# Altium schematic sheet Programming Interface and Power.SchDoc
size A
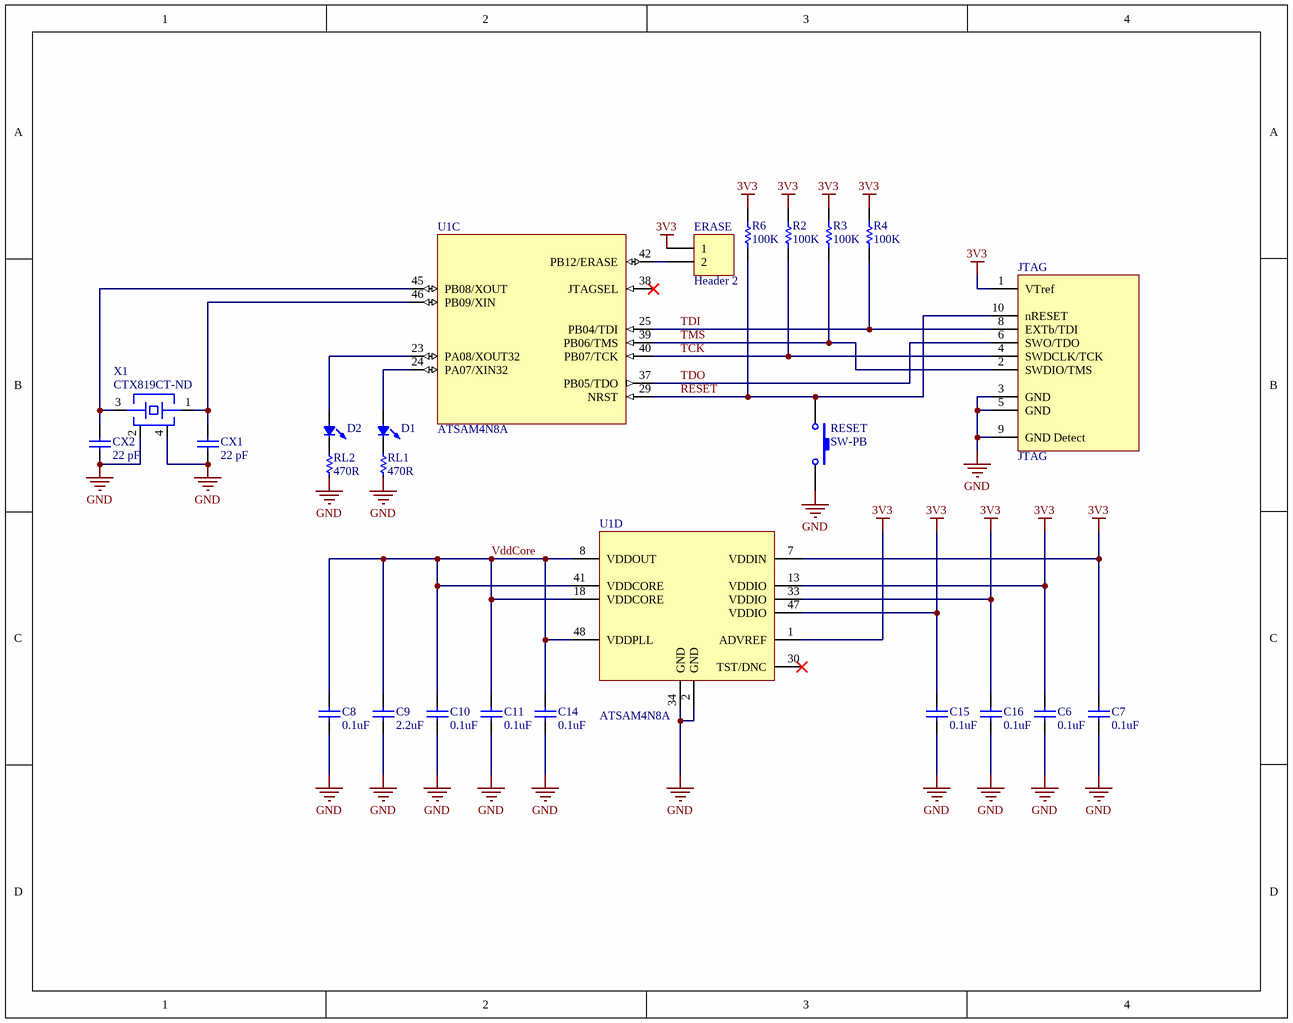
[diagram p0: Programming Interface and Power.SchDoc]

## Parts
C6  value 0.1uF  [0603C]  (hidden comment: Cap Semi)
C7  value 0.1uF  [0603C]  (hidden comment: Cap Semi)
C8  value 0.1uF  [0603C]  (hidden comment: Cap Semi)
C9  value 2.2uF  [1206C]  (hidden comment: Cap Semi)
C10  value 0.1uF  [0603C]  (hidden comment: Cap Semi)
C11  value 0.1uF  [0603C]  (hidden comment: Cap Semi)
C14  value 0.1uF  [0603C]  (hidden comment: Cap Semi)
C15  value 0.1uF  [0603C]  (hidden comment: Cap Semi)
C16  value 0.1uF  [0603C]  (hidden comment: Cap Semi)
CX1  value 22 pF  [0603C]  (hidden comment: Cap Semi)
CX2  value 22 pF  [0603C]  (hidden comment: Cap Semi)
D1  LED0  [0603 SMT LED]  (value not drawn)
D2  LED0  [0603 SMT LED]  (value not drawn)
ERASE  Header 2  [HDR1X2]
JTAG  JTAG  [MHDR2X5 - Shrouded]
R2  value 100K  [0603R]  (hidden comment: Res Semi)
R3  value 100K  [0603R]  (hidden comment: Res Semi)
R4  value 100K  [0603R]  (hidden comment: Res Semi)
R6  value 100K  [0603R]  (hidden comment: Res Semi)
RESET  SW-PB  [TL3302BF180QG/TR]
RL1  value 470R  [0603R]  (hidden comment: Res Semi Small)
RL2  value 470R  [0603R]  (hidden comment: Res Semi Small)
U1  ATSAM4N8A  [TSQFP50P900X900-48N]  (parts C,D of 4)
X1  CTX819CT-ND  [Abracon ABM3B Crystal]

## Nets
3V3: C6.2 C7.2 C15.2 C16.2 ERASE.1 JTAG.1(VTref) R2.2 R3.2 R4.2 R6.2 U1.1(ADVREF) U1.7(VDDIN) U1.13(VDDIO) U1.33(VDDIO) U1.47(VDDIO)
GND: C6.1 C7.1 C8.1 C9.1 C10.1 C11.1 C14.1 C15.1 C16.1 CX1.1 CX2.1 JTAG.3(GND) JTAG.5(GND) JTAG.9(GND_Detect) RESET.2 RL1.2 RL2.2 U1.2(GND) U1.34(GND) X1.2 X1.4
RESET: JTAG.10(nRESET) R6.1 RESET.1 U1.29(NRST)
TCK: JTAG.4(SWDCLK/TCK) R2.1 U1.40(PB07/TCK)
TDI: JTAG.8(EXTb/TDI) R4.1 U1.25(PB04/TDI)
TDO: JTAG.6(SWO/TDO) U1.37(PB05/TDO)
TMS: JTAG.2(SWDIO/TMS) R3.1 U1.39(PB06/TMS)
VddCore: C8.2 C9.2 C10.2 C11.2 C14.2 U1.8(VDDOUT) U1.18(VDDCORE) U1.41(VDDCORE) U1.48(VDDPLL)
NetCX1_2: CX1.2 U1.46(PB09/XIN) X1.1
NetCX2_2: CX2.2 U1.45(PB08/XOUT) X1.3
NetD1_1: D1.1 U1.24(PA07/XIN32)
NetD1_2: D1.2 RL1.1
NetD2_1: D2.1 U1.23(PA08/XOUT32)
NetD2_2: D2.2 RL2.1
NetERASE_2: ERASE.2 U1.42(PB12/ERASE)

Not connected (* = marked no-connect by the designer): U1 30(TST/DNC)* 38(JTAGSEL)*

## Library data of the parts
C6-C11 C14-C16 CX1 CX2 = Cap Semi: Capacitor (Semiconductor SIM Model); Published: 8-Jun-2000; LatestRevisionDate: 17-Jul-2002; LatestRevisionNote: Re-released for DXP Platform.; PackageReference: C1206; Publisher: Altium Limited
D1 D2 = LED0: T 1 3/4 LED; Published: 8-Jun-2000; LatestRevisionDate: 08-Jul-2005; LatestRevisionNote: Mech Layer 1 removed.; PackageReference: LED-0; Publisher: Altium Limited
ERASE = Header 2: Header, 2-Pin; LatestRevisionDate: 17-Jul-2002; LatestRevisionNote: Re-released for DXP Platform.; Publisher: Altium Limited
JTAG = ARM JTAG-10: ARM 10-Pin JTAG Interface
R2-R4 R6 = Res Semi: Semiconductor Resistor; Published: 8-Jun-2000; LatestRevisionDate: 17-Jul-2002; LatestRevisionNote: Re-released for DXP Platform.; PackageReference: AXIAL-0.5; Publisher: Altium Limited
RESET = SW-PB: Switch; Published: 24-Mar-1999; LatestRevisionDate: 17-Jul-2002; LatestRevisionNote: Re-released for DXP Platform.; PackageReference: SPST-2; Publisher: Altium Limited
RL1 RL2 = Res Semi Small: Semiconductor Resistor; Published: 8-Jun-2000; LatestRevisionDate: 17-Jul-2002; LatestRevisionNote: Re-released for DXP Platform.; PackageReference: AXIAL-0.5; Publisher: Altium Limited
U1 = ATSAM4N8A: SAM4N ARM Cortex-M4 Microcontrollers
X1 = SMT Crystal: 16 MHz Micro SMT Crystal; DKPN: 535-9122-1-ND; MFGPN: ABM3B-16.000MHZ-B2-T; DKDESC: CRYSTAL 16.000MHZ 18PF SMD